# EAGLE design cap-sensing (EAGLE 7.2.0)
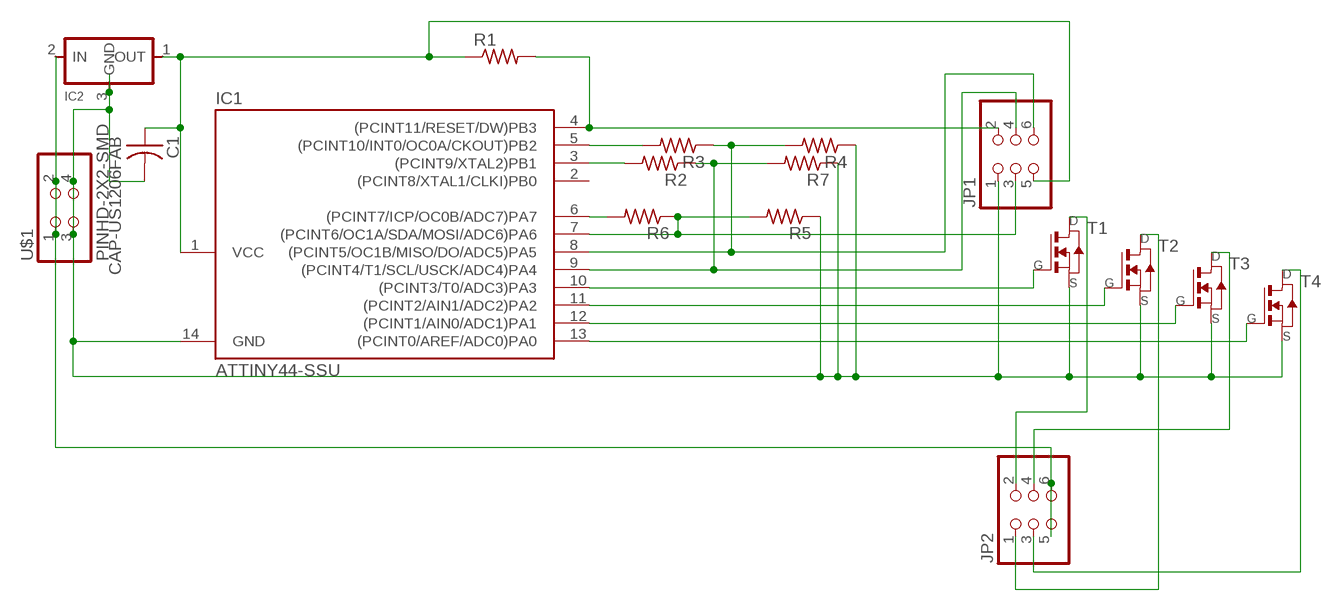
[diagram p0: schematic, sheet 1]

## Parts
C1  CAP-US1206FAB  [C1206FAB]
IC1  ATTINY44-SSU  [SOIC14]
IC2  REGULATORSOT23  [SOT23]
JP1  PINHD-2X3-SMD  [2X03SMD]
JP2  PINHD-2X3-SMD  [2X03SMD]
R1  RES-US1206FAB  [R1206FAB]
R2  RES-US1206FAB  [R1206FAB]
R3  RES-US1206FAB  [R1206FAB]
R4  RES-US1206FAB  [R1206FAB]
R5  RES-US1206FAB  [R1206FAB]
R6  RES-US1206FAB  [R1206FAB]
R7  RES-US1206FAB  [R1206FAB]
T1  NMOSFETSOT23  [SOT-23]
T2  NMOSFETSOT23  [SOT-23]
T3  NMOSFETSOT23  [SOT-23]
T4  NMOSFETSOT23  [SOT-23]
U$1  PINHD-2X2-SMD  [2X02SMD]

## Nets
N$1: IC1.5((PCINT10/INT0/OC0A/CKOUT)PB2) R3.2
N$2: C1.2 IC1.14(GND) IC2.3(GND) JP1.1 R4.1 R5.1 R7.1 T1.2(S) T2.2(S) T3.2(S) T4.2(S) U$1.3 U$1.4
N$3: C1.1 IC1.1(VCC) IC2.1(OUT) JP1.5 R1.1
N$4: IC1.4((PCINT11/RESET/DW)PB3) JP1.2 R1.2
N$5: IC1.9((PCINT4/T1/SCL/USCK/ADC4)PA4) JP1.4 R2.1 R7.2
N$7: IC1.7((PCINT6/OC1A/SDA/MOSI/ADC6)PA6) JP1.3 R5.2 R6.1
N$8: IC1.10((PCINT3/T0/ADC3)PA3) T1.3(G)
N$9: IC1.11((PCINT2/AIN1/ADC2)PA2) T2.3(G)
N$10: IC1.12((PCINT1/AIN0/ADC1)PA1) T3.3(G)
N$11: IC1.13((PCINT0/AREF/ADC0)PA0) T4.3(G)
N$12: JP2.2 T1.1(D)
N$13: JP2.4 T3.1(D)
N$14: JP2.1 T2.1(D)
N$15: JP2.3 T4.1(D)
N$16: IC2.2(IN) JP2.5 JP2.6 U$1.1 U$1.2
N$17: IC1.3((PCINT9/XTAL2)PB1) R2.2
N$18: IC1.6((PCINT7/ICP/OC0B/ADC7)PA7) R6.2
N$19: IC1.8((PCINT5/OC1B/MISO/DO/ADC5)PA5) JP1.6 R3.1 R4.2
Unconnected: IC1.2((PCINT8/XTAL1/CLKI)PB0)

## Library data of the parts
C1 = fab2015:CAP-US
IC1 = fab2015:ATTINY44
IC2 = fab2015:REGULATOR
JP1 JP2 = fab2015:PINHD-2X3-SMD: PIN HEADER
R1-R7 = fab2015:RES-US: Resistor (US Symbol) Variants with postfix FAB are widened to allow the routing of internal traces
T1-T4 = fab2015:NMOSFET: MOS FET
U$1 = fab2015:PINHD-2X2-SMD

## Board
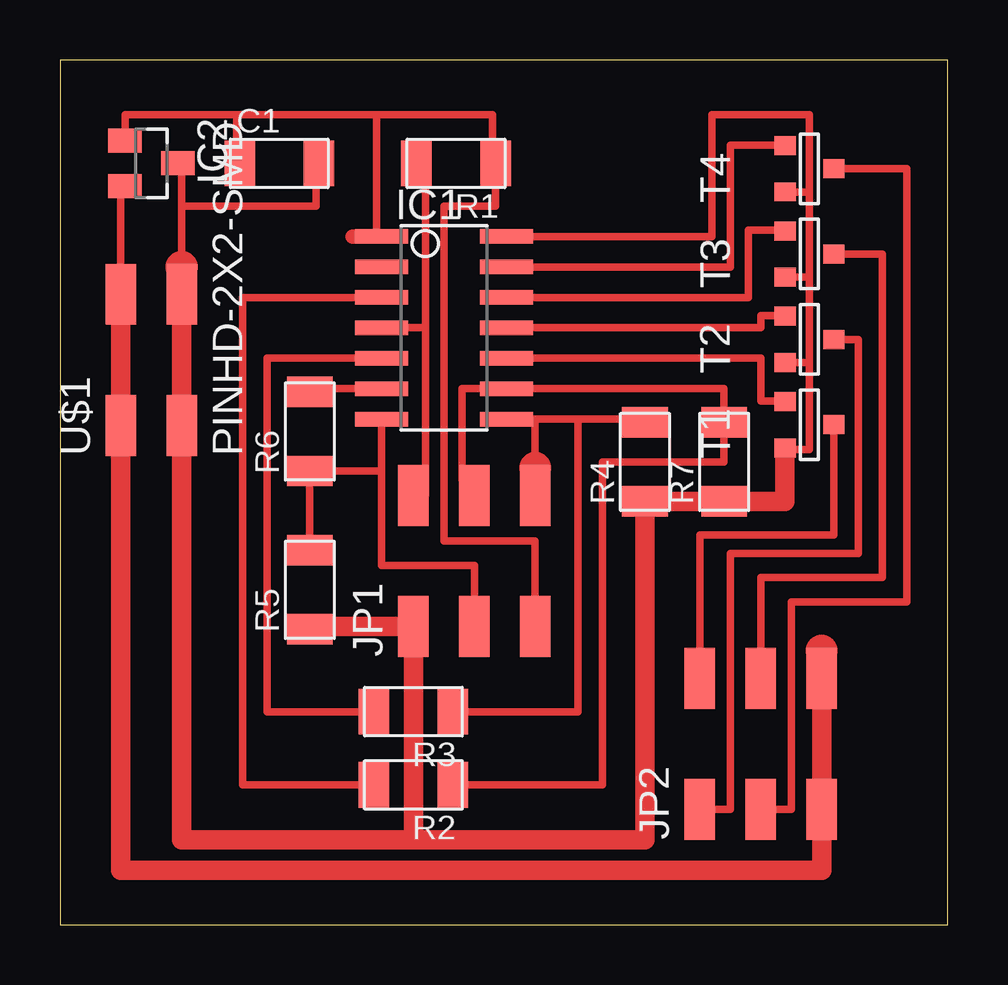
[diagram p1: board, top side]

Size 37.01 x 36.06 mm. Coordinates in mm from the lower left corner, seen from the top.
Outline: 0,0 37.01,0 37.01,36.06 0,36.06 0,0
Copper layers (1*16): Top 0.035mm / dielectric 1.5mm / Bottom 0.035mm
Design rules "default *": minimum track width 10mil, minimum drill 24mil, track to track 20mil, track to pad 8mil, pad to pad 8mil, via to via 8mil, smd to smd 20mil, copper to edge 40mil, drill to drill 8mil, minimum pad ring 10mil, minimum via ring 8mil, stop-mask expansion 4mil, vias tented up to drill 0mil, thermal gap 10mil

### Footprints (pad centres in the part's own frame; a part is rotated, then mirrored left to right if it is on the bottom)
C1206FAB = smd 1.27 x 1.905: 1 -1.651,0; 2 1.651,0
SOIC14 = smd 0.61 x 2.21: 1 -3.81,-2.603; 2 -2.54,-2.603; 3 -1.27,-2.603; 4 0,-2.603; 5 1.27,-2.603; 6 2.54,-2.603; 7 3.81,-2.603; 8 3.81,2.603; 9 2.54,2.603; 10 1.27,2.603; 11 0,2.603; 12 -1.27,2.603; 13 -2.54,2.603; 14 -3.81,2.603
SOT23 = smd 1 x 1.4: 1 -0.95,-1.1; 2 0.95,-1.1; 3 0,1.1
2X03SMD = smd 2.54 x 1.27: 1 -2.54,2.54; 2 2.92,2.54; 3 -2.54,0; 4 2.92,0; 5 -2.54,-2.54; 6 2.92,-2.54
R1206FAB = smd 1.27 x 1.905: 1 -1.651,0; 2 1.651,0
SOT-23 = smd 0.787 x 0.889: 1 0.025,-1.016; 2 -0.94,1.016; 3 0.991,1.016
2X02SMD = smd 2.54 x 1.27: 1 -2.54,1.27; 2 2.92,1.27; 3 -2.54,-1.27; 4 2.92,-1.27

### Placement (x,y rotation side)
C1  9.14,31.75 0 top
IC1  16,24.89 270 top
IC2  3.81,31.75 270 top
JP1  17.27,14.99 90 top
JP2  29.21,7.37 90 top
R1  16.51,31.75 180 top
R2  14.73,5.84 180 top
R3  14.73,8.89 180 top
R4  24.38,19.3 90 top
R5  10.41,13.97 90 top
R6  10.41,20.57 90 top
R7  27.69,19.3 90 top
T1  31.24,20.83 90 top
T2  31.24,24.38 90 top
T3  31.24,27.94 90 top
T4  31.24,31.5 90 top
U$1  3.81,23.37 90 top

### Tracks (layer width: path | path; a pad name or v marks a point on that pad's centre or on a via)
N$1
  Top 0.305: IC1.5 8.64,23.62 8.64,8.89 R3.2
N$2
  Top 0.305: IC1.14 27.18,28.7 27.18,33.78 31.24,33.78 31.24,30.56 | 31.24,30.56 31.24,27 | 31.24,27 31.24,23.44 | 31.24,23.44 31.24,19.81 30.23,19.81 T1.2 | T4.2 31.24,30.56 | T3.2 31.24,27 | T2.2 31.24,23.44 | 14.73,12.32 JP1.1 | IC2.3 5.08,31.75 5.08,29.97 | 5.08,29.97 U$1.4 | 10.92,31.75 C1.2 10.67,31.75 10.67,29.97 5.08,29.97
  Top 0.813: T1.2 30.23,17.65 R7.1 R4.1 24.38,3.56 14.73,3.56 | U$1.4 U$1.3 5.08,3.56 14.73,3.56 | 14.73,12.32 14.73,3.56 | JP1.1 10.41,12.45 R5.1
N$3
  Top 0.305: JP1.5 19.81,16 16,16 16,29.97 18.16,29.97 R1.1 18.03,31.75 18.03,33.78 13.21,33.78 | IC1.1 13.21,28.7 13.21,33.78 | 13.21,33.78 7.37,33.78 | 7.37,33.78 2.71,33.78 IC2.1 | C1.1 7.37,31.75 7.37,33.78
N$4
  Top 0.305: JP1.2 15.24,17.91 15.24,24.89 | 15.24,24.89 IC1.4 | R1.2 15.24,31.75 15.24,24.89
N$5
  Top 0.305: JP1.4 17.27,18.54 16.76,18.54 16.76,22.35 IC1.9 27.69,22.35 R7.2 27.69,19.3 22.61,19.3 22.61,5.84 R2.1
N$6
  Top 0.61: 12.19,28.7 12.45,28.7
N$7
  Top 0.305: JP1.3 17.27,14.99 13.4,14.99 13.4,18.92 | 13.4,18.92 IC1.7 | 13.4,18.92 R6.1 R5.2
N$8
  Top 0.305: IC1.10 29.21,23.62 29.21,21.84 30.23,21.84 T1.3
N$9
  Top 0.305: IC1.11 29.21,24.89 29.21,25.4 30.23,25.4 T2.3
N$10
  Top 0.305: IC1.12 28.7,26.16 28.7,28.96 30.23,28.96 T3.3
N$11
  Top 0.305: IC1.13 27.94,27.43 27.94,32.51 30.23,32.51 T4.3
N$12
  Top 0.305: T1.1 32.26,16.26 26.67,16.26 JP2.2
N$13
  Top 0.305: T3.1 34.29,27.96 34.29,14.48 29.21,14.48 JP2.4
N$14
  Top 0.305: T2.1 33.27,24.41 33.27,15.49 27.94,15.49 27.94,4.83 JP2.1
N$15
  Top 0.305: T4.1 35.31,31.52 35.31,13.46 30.48,13.46 30.48,4.83 JP2.3
N$16
  Top 0.305: IC2.2 2.54,30.8 U$1.2
  Top 0.813: U$1.2 U$1.1 2.54,2.29 31.75,2.29 JP2.5 JP2.6
N$17
  Top 0.305: IC1.3 7.62,26.16 7.62,5.84 R2.2
N$18
  Top 0.305: IC1.6 10.41,22.35 R6.2
N$19
  Top 0.305: JP1.6 19.81,21.08 | 19.81,21.08 IC1.8 | 19.81,21.08 21.59,21.08 | 21.59,21.08 24.38,21.08 R4.2 | R3.1 21.59,8.89 21.59,21.08
(copper drawn outside any net)
  shapes: Top circle x3